# Altium schematic sheet LED_Roulette_Wheel.SchDoc: LED ROULETTE
size Letter; Author: Denil Poudel; DrawnBy: Denil Poudel; Revision: -; SheetNumber: 1; SheetTotal: 1
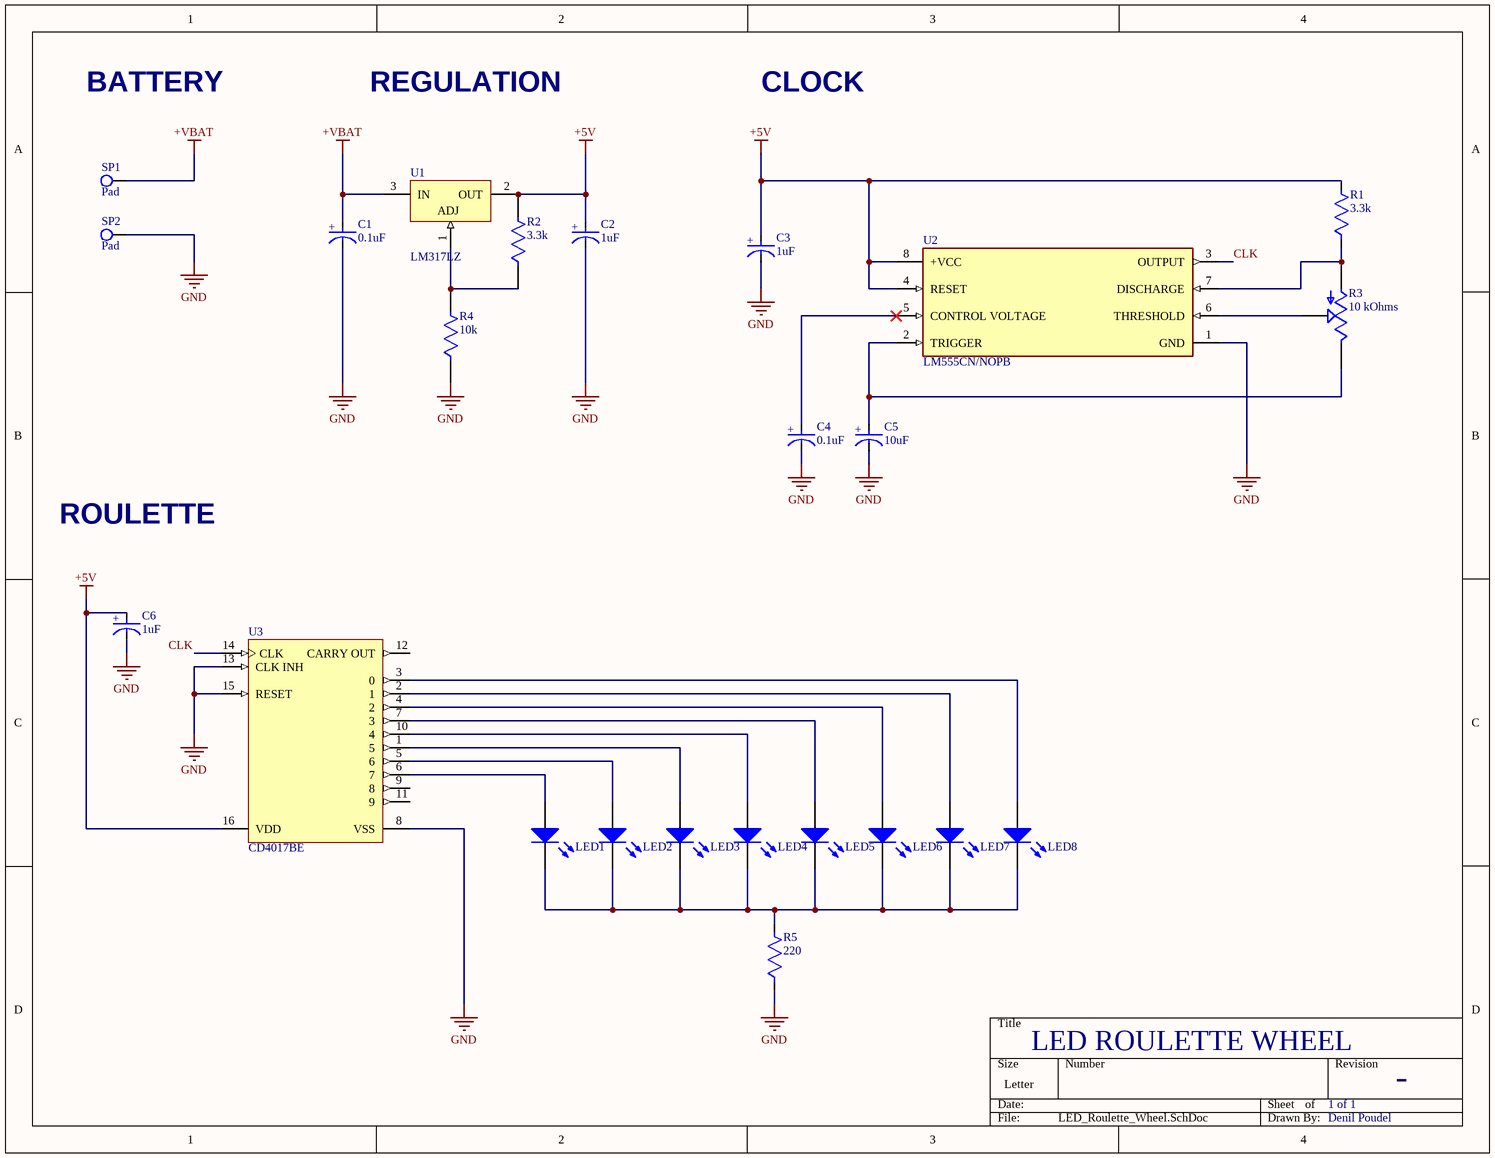
[diagram p0: LED_Roulette_Wheel.SchDoc]

## Parts
C1  0.1uF  [FP-UPW1E220MDD-MFG]
C2  1uF  [FP-UPW1E220MDD-MFG]
C3  1uF  [FP-UPW1E220MDD-MFG]
C4  0.1uF  [FP-UPW1E220MDD-MFG]
C5  10uF  [FP-UPW1E220MDD-MFG]
C6  1uF  [FP-UPW1E220MDD-MFG]
LED1  151051VS04000  [Type 5mm]  (value not drawn)
LED2  151051VS04000  [Type 5mm]  (value not drawn)
LED3  151051VS04000  [Type 5mm]  (value not drawn)
LED4  151051VS04000  [Type 5mm]  (value not drawn)
LED5  151051VS04000  [Type 5mm]  (value not drawn)
LED6  151051VS04000  [Type 5mm]  (value not drawn)
LED7  151051VS04000  [Type 5mm]  (value not drawn)
LED8  151051VS04000  [Type 5mm]  (value not drawn)
R1  3.3k  [FP-MFR-25-MFG]
R2  3.3k  [FP-MFR-25-MFG]
R3  10 kOhms  [TRIM_3362P-1-104TLF]
R4  10k  [FP-MFR-25-MFG]
R5  220  [FP-MFR-25-MFG]
SP1  Pad  [SP]
SP2  Pad  [SP]
U1  LM317LZ  [Z03A]
U2  LM555CN/NOPB  [FP-P0008A-MFG]
U3  CD4017BE  [N0016A]

## Nets
+5V: C2.2(A) C3.2(A) C6.2(A) R1.2 R2.2 U1.2(OUT) U2.4(RESET) U2.8(+VCC) U3.16(VDD)
+VBAT: C1.2(A) SP1.1 U1.3(IN)
GND: C1.1(C) C2.1(C) C3.1(C) C4.1(C) C5.1(C) C6.1(C) R4.1 R5.1 SP2.1 U2.1(GND) U3.8(VSS) U3.13(CLK_INH) U3.15(RESET)
CLK: U2.3(OUTPUT) U3.14(CLK)
NetC4_2: C4.2(A) U2.5(CONTROL_VOLTAGE)
NetC5_2: C5.2(A) R3.3(CW) U2.2(TRIGGER)
NetLED1_1: LED1.1(K) LED2.1(K) LED3.1(K) LED4.1(K) LED5.1(K) LED6.1(K) LED7.1(K) LED8.1(K) R5.2
NetLED1_2: LED1.2(A) U3.6(7)
NetLED2_2: LED2.2(A) U3.5(6)
NetLED3_2: LED3.2(A) U3.1(5)
NetLED4_2: LED4.2(A) U3.10(4)
NetLED5_2: LED5.2(A) U3.7(3)
NetLED6_2: LED6.2(A) U3.4(2)
NetLED7_2: LED7.2(A) U3.2(1)
NetLED8_2: LED8.2(A) U3.3(0)
NetR1_1: R1.1 R3.1(CCW) U2.7(DISCHARGE)
NetR2_1: R2.1 R4.2 U1.1(ADJ)
NetR3_2: R3.2(WIPER) U2.6(THRESHOLD)

Not connected (* = marked no-connect by the designer): U3 9(8) 11(9) 12(CARRY_OUT)

## Notes on the sheet
- BATTERY
- REGULATION
- CLOCK
- ROULETTE
- LED ROULETTE WHEEL
- 1 of 1
- -
- Denil Poudel
- (in symbol CMP-12462-000010-1) +

## Library data of the parts
C1-C6 = CMP-12462-000010-1: CAP ALUM 22UF 20% 25V RADIAL; Manufacturer: Nichicon; Manufacturer Part Number: UPW1E220MDD; Leakage Current: 16.5uA; Ripple Current: 180mA; Life: 2000Hours; Dissipation Factor: 14%; Description: 22uF 25 V dc Aluminium Electrolytic Capacitor, PW Series 2000h 5 (Dia.) x 11mm; Automotive Grade: Grade 2; Material: Aluminum; Voltage Rating: 25V; Device Class L1: Passive Components; ComponentLink2URL: https://products.nichicon.co.jp/en/pdf/XJA043/e-upw.pdf; Octopart: https://octopart.com/upw1e220mdd-nichicon-202818; RoHS: TRUE; Tolerance: 20%; Height: 12.5mm; Lead Free: Yes; Value: 22uF; Category: Cap; Temperature Range Low: -55°C; Device Class L3: Aluminum Electrolytic Capacitors; Package: 0; Capacitance: 22uF; Automotive: Yes; Digikey Description: CAP ALUM 22UF 20% 25V RADIAL; Temperature: -55°C to +105°C; Device Class L2: Capacitors; ComponentLink2Description: Datasheet; Temperature Range High: +105°C
LED1-LED8 = CMP-1488-00007-1: THT LED round mono-color color lens, WL-TMRW, Bright Green; Manufacturer: Wuerth Elektronik; Emitting color: Bright Green; ComponentLink1Description: Manufacturer URL; PackageReference: Type 5mm; PartNumber: 151051VS04000; ComponentLink2URL: http://katalog.we-online.de/pbs/datasheet/7448042001.pdfhttp://katalog.we-online.de/pbs/datasheet/7448042001.pdfhttp://katalog.we-online.de/pbs/datasheet/7448042001.pdfhttp://katalog.we-online.de/pbs/datasheet/151051VS04000.pdf; ComponentLink1URL: http://www.we-online.com; ComponentLink2Description: Datasheet
R1 R2 R4 R5 = CMP-03413-000001-1: RES 1.18K OHM 1/4W 1% AXIAL; Manufacturer: Yageo; Manufacturer Part Number: MFR-25FBF52-1K18; Value: 1.18kΩ; Description: 1.18 kOhms ±1% 0.25W, 1/4W Through Hole Resistor Axial  Metal Film; Temperature Coefficient: 100ppm/°C; Power Rating: 0.25W; Voltage Rating: 250V; Temperature: -55°C to +155°C; Automotive: No; Temperature Range High: +155°C; Mouser Description: Metal Film Resistors 1.18K OHM 1/4W 1%; Digikey Description: RES 1.18K OHM 1/4W 1% AXIAL; Lead Free: Yes; Tolerance: 1%; ComponentLink2Description: Datasheet; ComponentLink2URL: https://www.yageo.com/upload/media/product/products/datasheet/lr/Yageo_LR_MFR_1.pdf; Temperature Range Low: -55°C; Package: MFR-25; Ipc Land Pattern Name: RESAD1000W75L680D260; Composition: Metal Film; Category: Res; Octopart: https://octopart.com/mfr-25fbf52-1k18-yageo-56251681; Series: MFR; Device Class L2: Resistors; Height: 2.6mm; Resistance: 1.18kΩ; Device Class L3: Through-Hole Resistors; RoHS: TRUE; Device Class L1: Passive Components
R3 = 3362P-1-104TLF: 10 kOhms 0.5W, 1/2W PC Pins Through Hole Trimmer Potentiometer Cermet 1 Turn Top Finger Adjustment; MF: Bourns; Purchase-URL: https://pricing.snapeda.com/search/part/3362P-1-104TLF/?ref=eda; MP: 3362P-1-104TLF; Package: 3362P-1-T Bourns Inc.; SnapEDA_Link: https://www.snapeda.com/parts/3362P-1-104TLF/Bourns/view-part/1448275/?ref=snap; Availability: Warning; Price: None; Value: *; Check_prices: https://www.snapeda.com/parts/3362P-1-104TLF/Bourns/view-part/1448275/?ref=eda
SP1 SP2 = SP
U1 = CMP-0062-00072-2: 3-Terminal Adjustable Regulator, 3-pin TO-92; Manufacturer: National Semiconductor; CompType: LDO IC; PackageTopMarking: NSXYTT*LM317*LZ; PowerWise: N; ComponentLink1URL: http://www.national.com/ds/LM/LM317L.pdf; PackageReference: Z03A; ComponentLink3URL: http://www.national.com/packaging/folders/z03a.html; ComponentLink2Description: LM317L Web Page; ComponentLink3Description: Z03A Package Page; RoHS: N; DatasheetVersion: Apr-2008; PinCount: 3; PackageVersion: revG, Sep-2000; ComponentLink2URL: http://www.national.com/pf/LM/LM317L.html; RevisionNote: Component URLs added; PackageDescription: TO-92, Molded, 3 Lead; ComponentLink1Description: LM317L Datasheet; Code_JEDEC: TO-226-AA
U2 = CMP-0056-00016-4: IC OSC SINGLE TIMER 100KHZ 8-DIP; Manufacturer: Texas Instruments; Min Supply Voltage: 4.5V; Standoff Height: 0.51mm; Number Of Timers/Counters: 1; Max Supply Voltage: 16V; Max Junction Temp: +70°C; Nominal Supply Current: 3mA; ComponentLink2Description: Datasheet; Category: IC; Manufacturer Part Number: LM555CN/NOPB; Digikey Description: IC OSC SINGLE TIMER 100KHZ 8-DIP; Ambient Temperature Range High: +70°C; Automotive: No; Device Class L3: Timers and Oscillators; Device Class L1: Integrated Circuits (ICs); Temperature Range High: +70°C; Lead Free: Yes; ComponentLink2URL: http://www.ti.com/lit/ds/symlink/lm555.pdf; Octopart: https://octopart.com/lm555cn%2Fnopb-texas+instruments-24814897; RoHS: TRUE; Ambient Temperature Range Low: 0°C; Temperature Range Low: 0°C; Package: P0008A; Temperature: 0°C to +70°C; Height: 5.08mm; Device Class L2: Clock and Timing
U3 = CMP-1623-00541-2: CMOS Decade Counter with 10 Decoded Outputs, N0016A, TUBE; Manufacturer: Texas Instruments; Schmitt Trigger: No; VCC(Max)(V): 18; tpd @ Nom Voltage(Max)(ns): 270; ICC @ Nom Voltage(Max)(mA): 0.03; Output Drive (IOL/IOH)(Max)(mA): 1.5/-1.5; VCC(Min)(V): 3; F @ Nom Voltage(Max)(Mhz): 8; Rating: Military; Technology Family: CD4000; Bits(#): 10; Inputs: 1; Type: Decade; Operating Temperature Range(C): -55 to 125; Output Type: CMOS; Code_JEDEC: MS-001; Function: Counter; PackageReference: N0016A; DatasheetVersion: SCHS027C; Input Type: CMOS; Generic Part Number: CD4017B; Voltage(Nom)(V): 10